# EAGLE schematic Структурная схема (EAGLE 9.6.2)
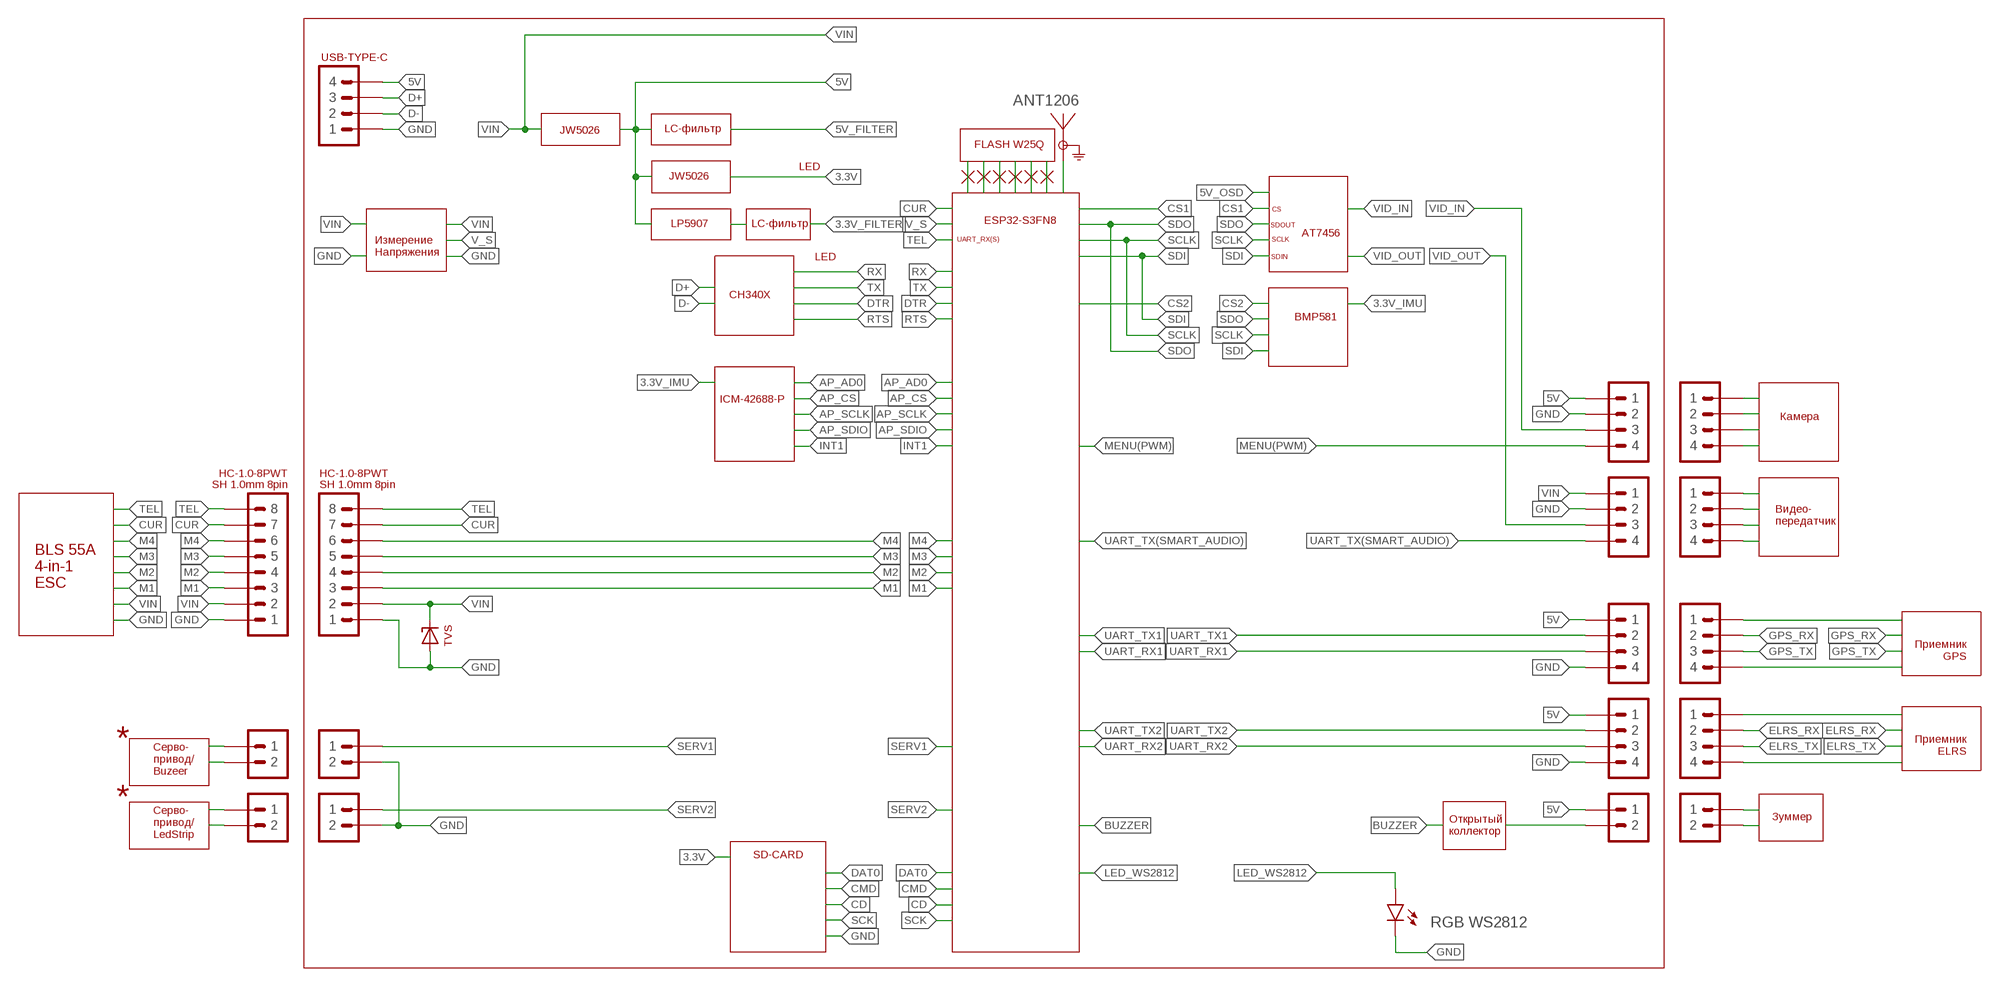
[diagram p0: schematic, sheet 1]

## Parts
LED2  RGB WS2812  LED2013  [2013]
U$2  ANT1206  [1206]
X1  1X4JST-XH-04  [JST-XH-04]
X2  1X4JST-XH-04  [JST-XH-04]
X3  1X8JST-XH-08  [JST-XH-08]
X4  1X4JST-XH-04  [JST-XH-04]
X5  1X4JST-XH-04  [JST-XH-04]
X6  1X4JST-XH-04  [JST-XH-04]
X7  1X4JST-XH-04  [JST-XH-04]
X8  1X4JST-XH-04  [JST-XH-04]
X9  1X4JST-XH-04  [JST-XH-04]
X10  1X4JST-XH-04  [JST-XH-04]
X11  1X8JST-XH-08  [JST-XH-08]
X12  1X2JST-XH-02  [JST-XH-02]
X13  1X2JST-XH-02  [JST-XH-02]
X23  1X2JST-XH-02  [JST-XH-02]
X24  1X2JST-XH-02  [JST-XH-02]
X29  1X2JST-XH-02  [JST-XH-02]
X30  1X2JST-XH-02  [JST-XH-02]
ZD1  ZENER-DIODESSOD123  [SOD123]

## Nets
5V: X1.1 X2.1 X6.1 X9.4 X12.1
CUR: X3.7 X11.7
D+: X9.3
D-: X9.2
DTR2: X4.1 X5.1
ELRS_RX: X5.2
ELRS_TX: X5.3
GND: LED2.P$1(C) X1.4 X2.4 X3.1 X6.2 X8.2 X9.1 X11.1 X23.2 X24.2 ZD1.A
GPS_RX: X4.2
GPS_TX: X4.3
LED_WS2812: LED2.P$2(A)
M1: X3.3 X11.3
M2: X3.4 X11.4
M3: X3.5 X11.5
M4: X3.6 X11.6
MENU(PWM): X6.4
N$3: X7.4
N$4: X7.3
N$5: X7.2
N$6: X7.1
N$8: X13.1
N$9: X10.1
N$10: X10.2
N$11: X10.3
N$15: U$2.1(ANT)
N$16: X10.4
N$17: X13.2
N$19: X12.2
N$32: X29.2
N$33: X29.1
N$34: X30.2
N$35: X30.1
RX2: X4.4 X5.4
SERV1: X23.1
SERV2: X24.1
TEL: X3.8 X11.8
UART_RX1: X1.3
UART_RX2: X2.3
UART_TX1: X1.2
UART_TX2: X2.2
UART_TX(SMART_AUDIO): X8.4
VID_IN: X6.3
VID_OUT: X8.3
VIN: X3.2 X8.1 X11.2 ZD1.C
Unconnected: U$2.2(GND)

## Notes on the sheet
- USB-TYPE-C
- JW5026
- LC-фильтр
- FLASH W25Q
- JW5026 | LED
- CS
- ESP32-S3FN8
- LP5907 | LC-фильтр | SDOUT
- AT7456
- UART_RX(S) | SCLK
- Измерение
  Напряжения
- LED | SDIN
- CH340X
- BMP581
- ICM-42688-P
- Камера
- HC-1.0-8PWT
- SH 1.0mm 8pin | HC-1.0-8PWT
- SH 1.0mm 8pin
- Видео-
  передатчик
- BLS 55A 
  4-in-1 
  ESC
- Приемник
      GPS
- TVS
- Приемник
      ELRS
- Серво-
  привод/
  Buzeer
- *
- Серво-
  привод/
  LedStrip
- *
- Зуммер
- Открытый
  коллектор
- SD-CARD

## Library data of the parts
LED2 = LARS_409_LED:LED
U$2 = LARS_409_RADIO:ANT1206
X1 X2 X4-X10 = LARS_409_CONNECTORS:1X4
X3 X11 = LARS_409_CONNECTORS:1X8
X12 X13 X23 X24 X29 X30 = LARS_409_CONNECTORS:1X2
ZD1 = LARS_409_DIODE:ZENER-DIODES